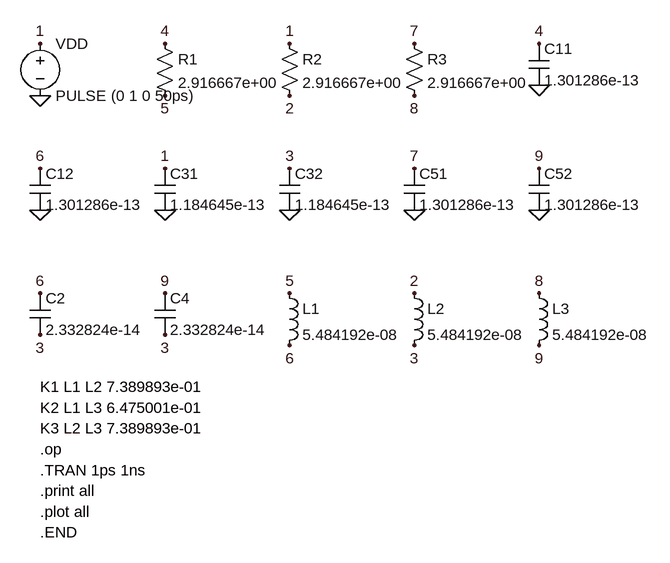
[diagram p0: schematic rlc.asc]
rlc.asc, the LTspice schematic file:
Version 4
SHEET 1 960 720
SYMBOL voltage 0 48 R0
SYMATTR InstName VDD
SYMATTR Value PULSE (0 1 0 50ps)
FLAG 0 64 1
FLAG 0 144 0
SYMBOL res 176 48 R0
SYMATTR InstName R1
SYMATTR Value 2.916667e+00
FLAG 192 64 4
FLAG 192 144 5
SYMBOL res 368 48 R0
SYMATTR InstName R2
SYMATTR Value 2.916667e+00
FLAG 384 64 1
FLAG 384 144 2
SYMBOL res 560 48 R0
SYMATTR InstName R3
SYMATTR Value 2.916667e+00
FLAG 576 64 7
FLAG 576 144 8
SYMBOL cap 752 64 R0
SYMATTR InstName C11
SYMATTR Value 1.301286e-13
FLAG 768 64 4
FLAG 768 128 0
SYMBOL cap -16 256 R0
SYMATTR InstName C12
SYMATTR Value 1.301286e-13
FLAG 0 256 6
FLAG 0 320 0
SYMBOL cap 176 256 R0
SYMATTR InstName C31
SYMATTR Value 1.184645e-13
FLAG 192 256 1
FLAG 192 320 0
SYMBOL cap 368 256 R0
SYMATTR InstName C32
SYMATTR Value 1.184645e-13
FLAG 384 256 3
FLAG 384 320 0
SYMBOL cap 560 256 R0
SYMATTR InstName C51
SYMATTR Value 1.301286e-13
FLAG 576 256 7
FLAG 576 320 0
SYMBOL cap 752 256 R0
SYMATTR InstName C52
SYMATTR Value 1.301286e-13
FLAG 768 256 9
FLAG 768 320 0
SYMBOL cap -16 448 R0
SYMATTR InstName C2
SYMATTR Value 2.332824e-14
FLAG 0 448 6
FLAG 0 512 3
SYMBOL cap 176 448 R0
SYMATTR InstName C4
SYMATTR Value 2.332824e-14
FLAG 192 448 9
FLAG 192 512 3
SYMBOL ind 368 432 R0
SYMATTR InstName L1
SYMATTR Value 5.484192e-08
FLAG 384 448 5
FLAG 384 528 6
SYMBOL ind 560 432 R0
SYMATTR InstName L2
SYMATTR Value 5.484192e-08
FLAG 576 448 2
FLAG 576 528 3
SYMBOL ind 752 432 R0
SYMATTR InstName L3
SYMATTR Value 5.484192e-08
FLAG 768 448 8
FLAG 768 528 9
TEXT 0 592 Left 2 !K1 L1 L2 7.389893e-01
TEXT 0 624 Left 2 !K2 L1 L3 6.475001e-01
TEXT 0 656 Left 2 !K3 L2 L3 7.389893e-01
TEXT 0 688 Left 2 !.op
TEXT 0 720 Left 2 !.TRAN 1ps 1ns
TEXT 0 752 Left 2 !.print all
TEXT 0 784 Left 2 !.plot all
TEXT 0 816 Left 2 !.END

The netlist it stands for:
* rlc.asc
VDD 1 0 PULSE (0 1 0 50ps)
R1 4 5 2.916667e+00
R2 1 2 2.916667e+00
R3 7 8 2.916667e+00
C11 4 0 1.301286e-13
C12 6 0 1.301286e-13
C31 1 0 1.184645e-13
C32 3 0 1.184645e-13
C51 7 0 1.301286e-13
C52 9 0 1.301286e-13
C2 6 3 2.332824e-14
C4 9 3 2.332824e-14
L1 5 6 5.484192e-08
L2 2 3 5.484192e-08
L3 8 9 5.484192e-08
K1 L1 L2 7.389893e-01
K2 L1 L3 6.475001e-01
K3 L2 L3 7.389893e-01
.op
.TRAN 1ps 1ns
.print all
.plot all
.END
.backanno
.end